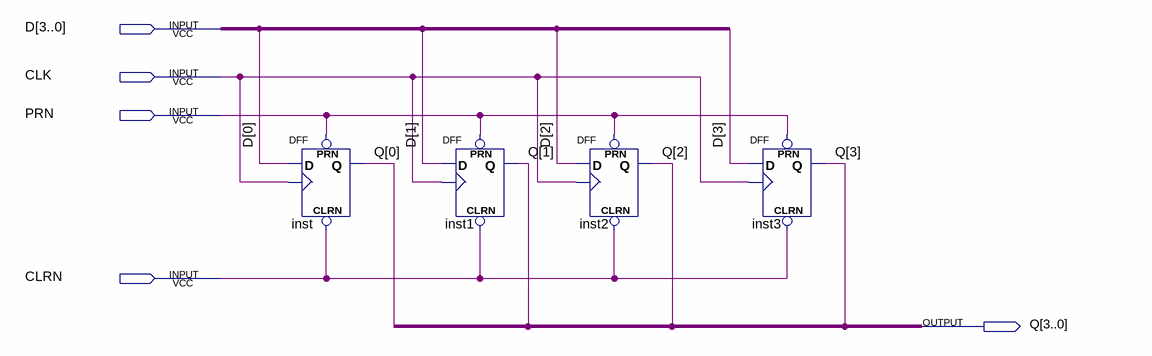
[diagram p0: schematic sheet]
// Quartus schematic d_flip_flop_4bit.bdf as structural Verilog: 4 symbols, 5 pins
module d_flip_flop_4bit (
  input  [3:0] D,
  input  CLK,
  input  PRN,
  input  CLRN,
  output [3:0] Q
);

  DFF inst (.CLRN(CLRN), .CLK(CLK), .D(D[0]), .PRN(PRN), .Q(Q[0]));
  DFF inst1 (.CLRN(CLRN), .CLK(CLK), .D(D[1]), .PRN(PRN), .Q(Q[1]));
  DFF inst2 (.CLRN(CLRN), .CLK(CLK), .D(D[2]), .PRN(PRN), .Q(Q[2]));
  DFF inst3 (.CLRN(CLRN), .CLK(CLK), .D(D[3]), .PRN(PRN), .Q(Q[3]));
endmodule
